# Altium schematic sheet eth_part.SchDoc
size A3
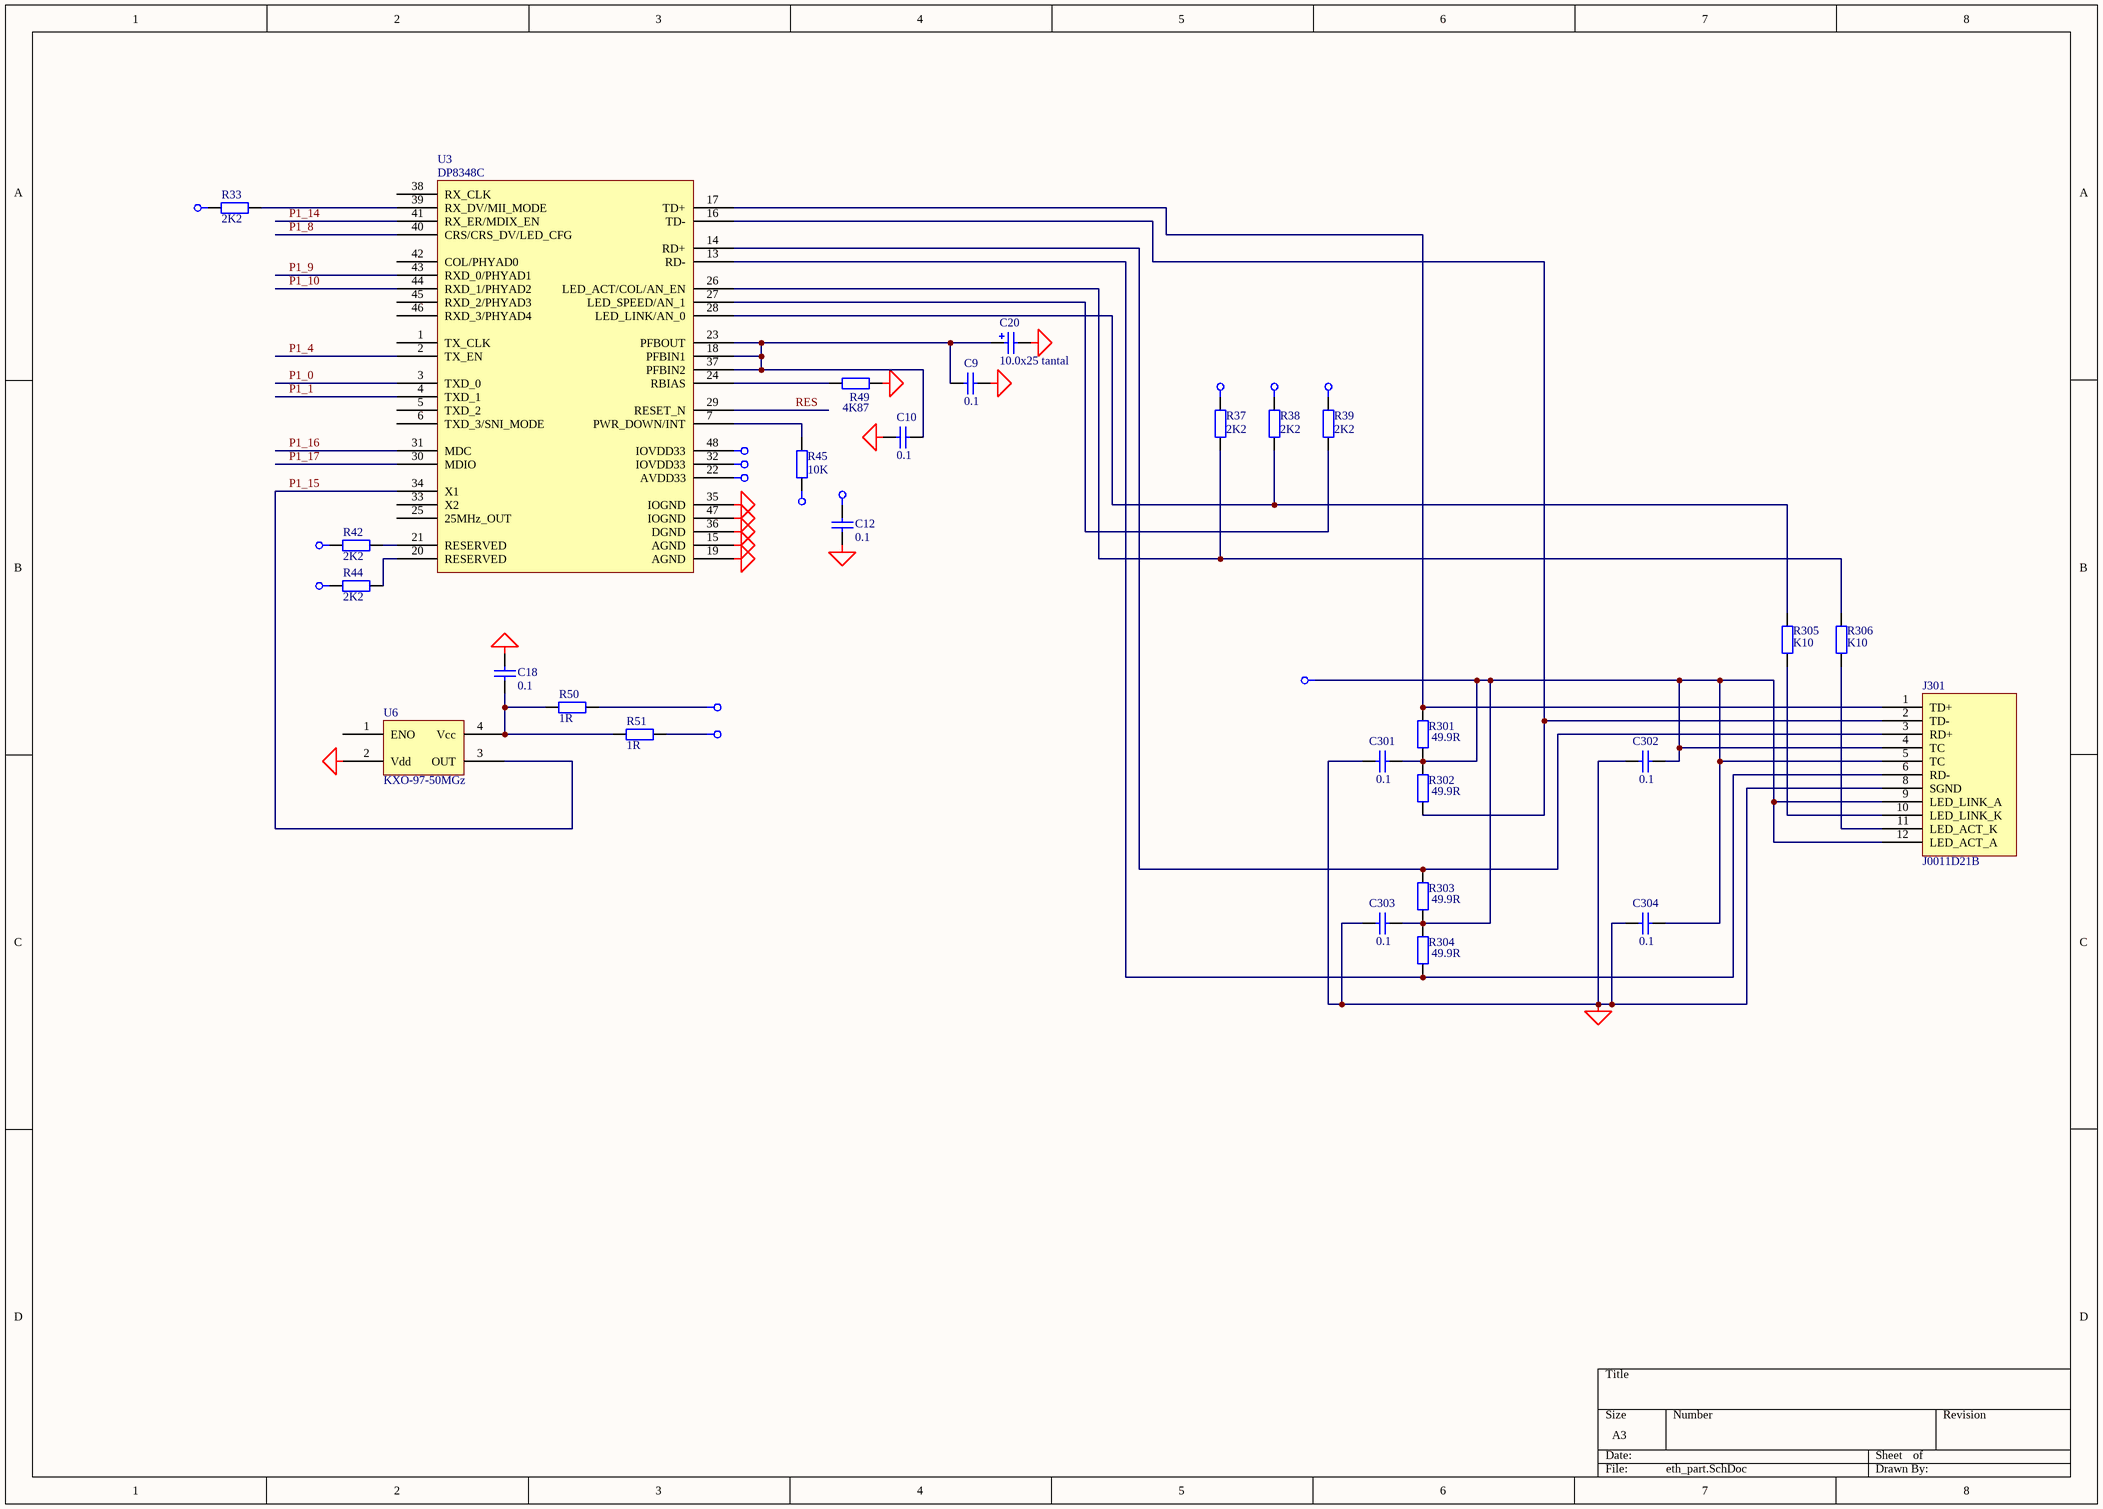
[diagram p0: eth_part.SchDoc]

## Parts
C9  0.1  [C3216-1206]
C10  0.1  [C3216-1206]
C12  0.1  [_1206]
C18  0.1  [_1206]
C20  10.0x25 tantal  [CAP_EL_6_3]
C301  0.1  [C3216-1206]
C302  0.1  [C3216-1206]
C303  0.1  [C3216-1206]
C304  0.1  [C3216-1206]
J301  J0011D21B  [J0011D21B]
R33  2K2  [_1206]
R37  2K2  [_1206]
R38  2K2  [_1206]
R39  2K2  [_1206]
R42  2K2  [_1206]
R44  2K2  [_1206]
R45  10K  [_1206]
R49  4K87  [_1206]
R50  1R  [_1206]
R51  1R  [_1206]
R301  49.9R  [_1206]
R302  49.9R  [_1206]
R303  49.9R  [_1206]
R304  49.9R  [_1206]
R305  K10  [_1206]
R306  K10  [_1206]
U3  DP8348C  [F-QFP7X7-G48/N]
U6  KXO-97-50MGz  [KXO-97]

## Nets
+3v3: C12.1 C301.2 C302.2 C303.2 C304.2 J301.4(TC) J301.5(TC) J301.9(LED_LINK_A) J301.12(LED_ACT_A) R33.2 R37.2 R38.2 R39.2 R42.2 R44.2 R45.2 R51.2 R301.2 R302.1 R303.2 R304.1 U3.22(AVDD33) U3.32(IOVDD33) U3.48(IOVDD33)
+5v: R50.2
GND: C9.2 C10.2 C12.2 C18.2 C20.2 C301.1 C302.1 C303.1 C304.1 J301.8(SGND) R49.1 U3.15(AGND) U3.19(AGND) U3.35(IOGND) U3.36(DGND) U3.47(IOGND) U6.2(Vdd)
P1_0: U3.3(TXD_0)
P1_1: U3.4(TXD_1)
P1_4: U3.2(TX_EN)
P1_8: U3.40(CRS/CRS_DV/LED_CFG)
P1_9: U3.43(RXD_0/PHYAD1)
P1_10: U3.44(RXD_1/PHYAD2)
P1_14: U3.41(RX_ER/MDIX_EN)
P1_15: U3.34(X1) U6.3(OUT)
P1_16: U3.31(MDC)
P1_17: U3.30(MDIO)
RES: U3.29(RESET_N)
NetC9_1: C9.1 C10.1 C20.1 U3.18(PFBIN1) U3.23(PFBOUT) U3.37(PFBIN2)
NetC18_1: C18.1 R50.1 R51.1 U6.4(Vcc)
NetJ301_1: J301.1(TD+) R301.1 U3.17(TD+)
NetJ301_2: J301.2(TD-) R302.2 U3.16(TD-)
NetJ301_3: J301.3(RD+) R303.1 U3.14(RD+)
NetJ301_6: J301.6(RD-) R304.2 U3.13(RD-)
NetJ301_10: J301.10(LED_LINK_K) R305.1
NetJ301_11: J301.11(LED_ACT_K) R306.1
NetR33_1: R33.1 U3.39(RX_DV/MII_MODE)
NetR37_1: R37.1 R306.2 U3.26(LED_ACT/COL/AN_EN)
NetR38_1: R38.1 R305.2 U3.28(LED_LINK/AN_0)
NetR39_1: R39.1 U3.27(LED_SPEED/AN_1)
NetR42_1: R42.1 U3.21(RESERVED)
NetR44_1: R44.1 U3.20(RESERVED)
NetR45_1: R45.1 U3.7(PWR_DOWN/INT)
NetR49_2: R49.2 U3.24(RBIAS)

Not connected (* = marked no-connect by the designer): U3 1(TX_CLK) 5(TXD_2) 6(TXD_3/SNI_MODE) 25(25MHz_OUT) 33(X2) 38(RX_CLK) 42(COL/PHYAD0) 45(RXD_2/PHYAD3) 46(RXD_3/PHYAD4); U6 1(ENO)

## Library data of the parts
C9 C10 C12 C18 C301-C304 = Cap Semi: Capacitor (Semiconductor SIM Model); Manufacturer: Generic Components; Class I: Passive; Value: 1,0; Published: 8-Jun-2000; Revision: July-2002: Re-released for DXP Platform.; Publisher: Altium Limited; Class II: Capacitor
C20 = Cap Pol1: Polarized Capacitor (Radial); Manufacturer: Generic Components; Class I: Passive; Value: 10,0x25; Published: 8-Jun-2000; Revision: July-2002: Re-released for DXP Platform.; Publisher: Altium Limited; Class II: Capacitor
R33 R37-R39 R42 R44 R49-R51 = Res2: Resistor; Manufacturer: Generic Components; Class I: Passive; Value: 10K; Rule: Undefined; Published: 8-Jun-2000; Revision: July-2002: Re-released for DXP Platform.; Publisher: Altium Limited; Class II: Resistor
R45 = Res2: Resistor; Manufacturer: Generic Components; Class I: Passive; Rule: Undefined; Published: 8-Jun-2000; Revision: July-2002: Re-released for DXP Platform.; Publisher: Altium Limited; Class II: Resistor; Value: 10K
R301-R306 = Res2: Resistor; Manufacturer: Generic Components; Class I: Passive; Value: 30; Rule: Undefined; Published: 8-Jun-2000; Revision: July-2002: Re-released for DXP Platform.; Publisher: Altium Limited; Class II: Resistor
U6 = KXO-97